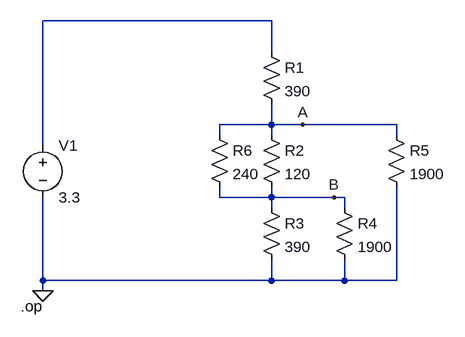
[diagram p0: schematic RS485.asc]
RS485.asc, the LTspice schematic file:
Version 4
SHEET 1 880 680
WIRE 208 -16 -144 -16
WIRE 208 32 208 -16
WIRE 208 144 208 112
WIRE 208 144 128 144
WIRE 256 144 208 144
WIRE 400 144 256 144
WIRE 128 160 128 144
WIRE 208 160 208 144
WIRE 400 160 400 144
WIRE -144 176 -144 -16
WIRE 128 256 128 240
WIRE 208 256 208 240
WIRE 208 256 128 256
WIRE 304 256 208 256
WIRE 320 256 304 256
WIRE 208 272 208 256
WIRE 320 272 320 256
WIRE -144 384 -144 256
WIRE 208 384 208 352
WIRE 208 384 -144 384
WIRE 320 384 320 352
WIRE 320 384 208 384
WIRE 400 384 400 240
WIRE 400 384 320 384
WIRE -144 400 -144 384
FLAG -144 400 0
FLAG 256 144 A
FLAG 304 256 B
DATAFLAG 400 144 "$-V(B)"
SYMBOL voltage -144 160 R0
SYMATTR InstName V1
SYMATTR Value 3.3
SYMBOL res 192 16 R0
SYMATTR InstName R1
SYMATTR Value 390
SYMBOL res 192 144 R0
SYMATTR InstName R2
SYMATTR Value 120
SYMBOL res 192 256 R0
SYMATTR InstName R3
SYMATTR Value 390
SYMBOL res 304 256 R0
SYMATTR InstName R4
SYMATTR Value 1900
SYMBOL res 384 144 R0
SYMATTR InstName R5
SYMATTR Value 1900
SYMBOL res 112 144 R0
SYMATTR InstName R6
SYMATTR Value 240
TEXT -178 424 Left 2 !.op

The netlist it stands for:
* RS485.asc
V1 N001 0 3.3
R1 N001 A 390
R2 A B 120
R3 B 0 390
R4 B 0 1900
R5 A 0 1900
R6 A B 240
.op
.backanno
.end